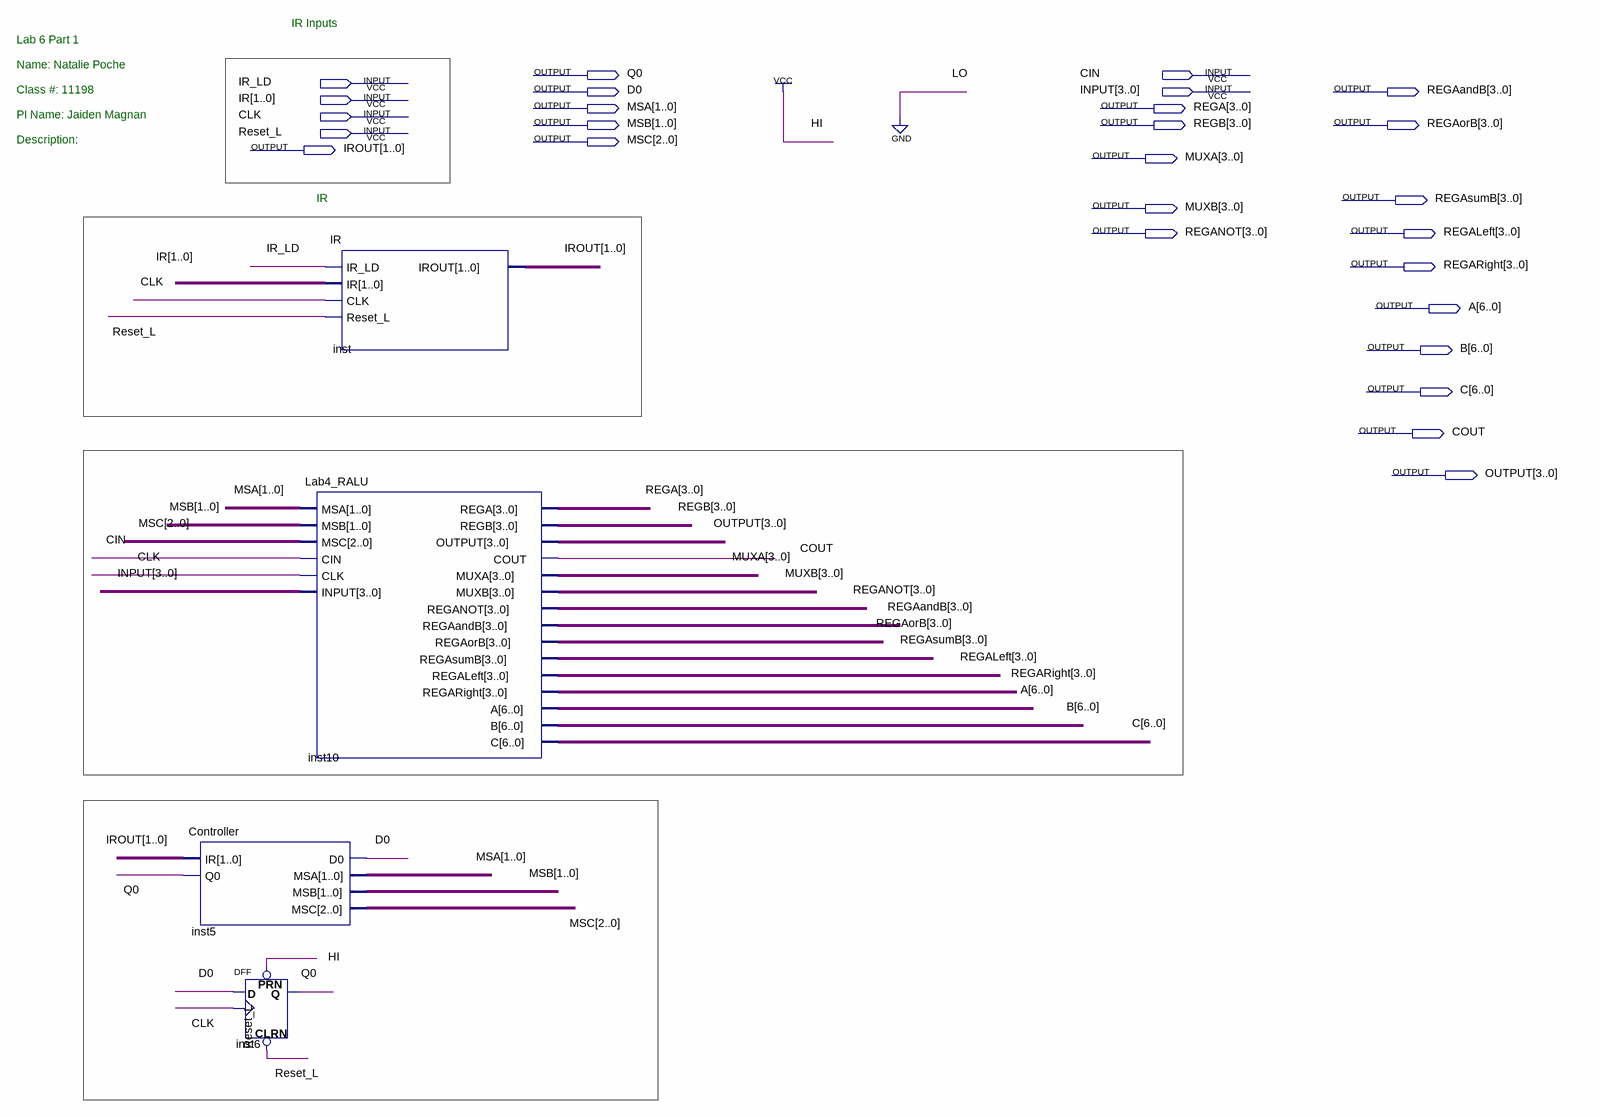
[diagram p0: schematic sheet]
// Quartus schematic lab6_part1.bdf as structural Verilog: 4 symbols, 27 pins
module lab6_part1 (
  input  CIN,
  input  IR_LD,
  input  [3:0] INPUT,
  input  [1:0] IR,
  input  CLK,
  input  Reset_L,
  output Q0,
  output D0,
  output [3:0] REGAandB,
  output [1:0] MSA,
  output [3:0] REGA,
  output [1:0] MSB,
  output [3:0] REGB,
  output [3:0] REGAorB,
  output [2:0] MSC,
  output [1:0] IROUT,
  output [3:0] MUXA,
  output [3:0] REGAsumB,
  output [3:0] MUXB,
  output [3:0] REGANOT,
  output [3:0] REGALeft,
  output [3:0] REGARight,
  output [6:0] A,
  output [6:0] B,
  output [6:0] C,
  output COUT,
  output [3:0] OUTPUT
);

  Controller inst5 (.IR(IROUT), .Q0(Q0), .D0(D0), .MSA(MSA), .MSB(MSB), .MSC(MSC));
  DFF inst6 (.CLRN(Reset_L), .CLK(CLK), .D(D0), .PRN(1'b1), .Q(Q0));
  Lab4_RALU inst10 (
    .MSA(MSA), .MSB(MSB), .MSC(MSC), .CIN(CIN), .CLK(CLK), .INPUT(INPUT), .REGA(REGA), .REGB(REGB),
    .OUTPUT(OUTPUT), .COUT(COUT), .MUXA(MUXA), .MUXB(MUXB), .REGANOT(REGANOT), .REGAandB(REGAandB),
    .REGAorB(REGAorB), .REGAsumB(REGAsumB), .REGALeft(REGALeft), .REGARight(REGARight), .A(A), .B(B), .C(C));
  IR inst (.IR_LD(IR_LD), .IR(IR), .CLK(CLK), .Reset_L(Reset_L), .IROUT(IROUT));

  // Notes on the sheet:
  //   IR Inputs
  //   Lab 6 Part 1
  //   Name: Natalie Poche
  //   Class #: 11198
  //   PI Name: Jaiden Magnan
  //   Description: 
  //   IR
endmodule
